# EAGLE schematic porta_stella (EAGLE 9.1.3)
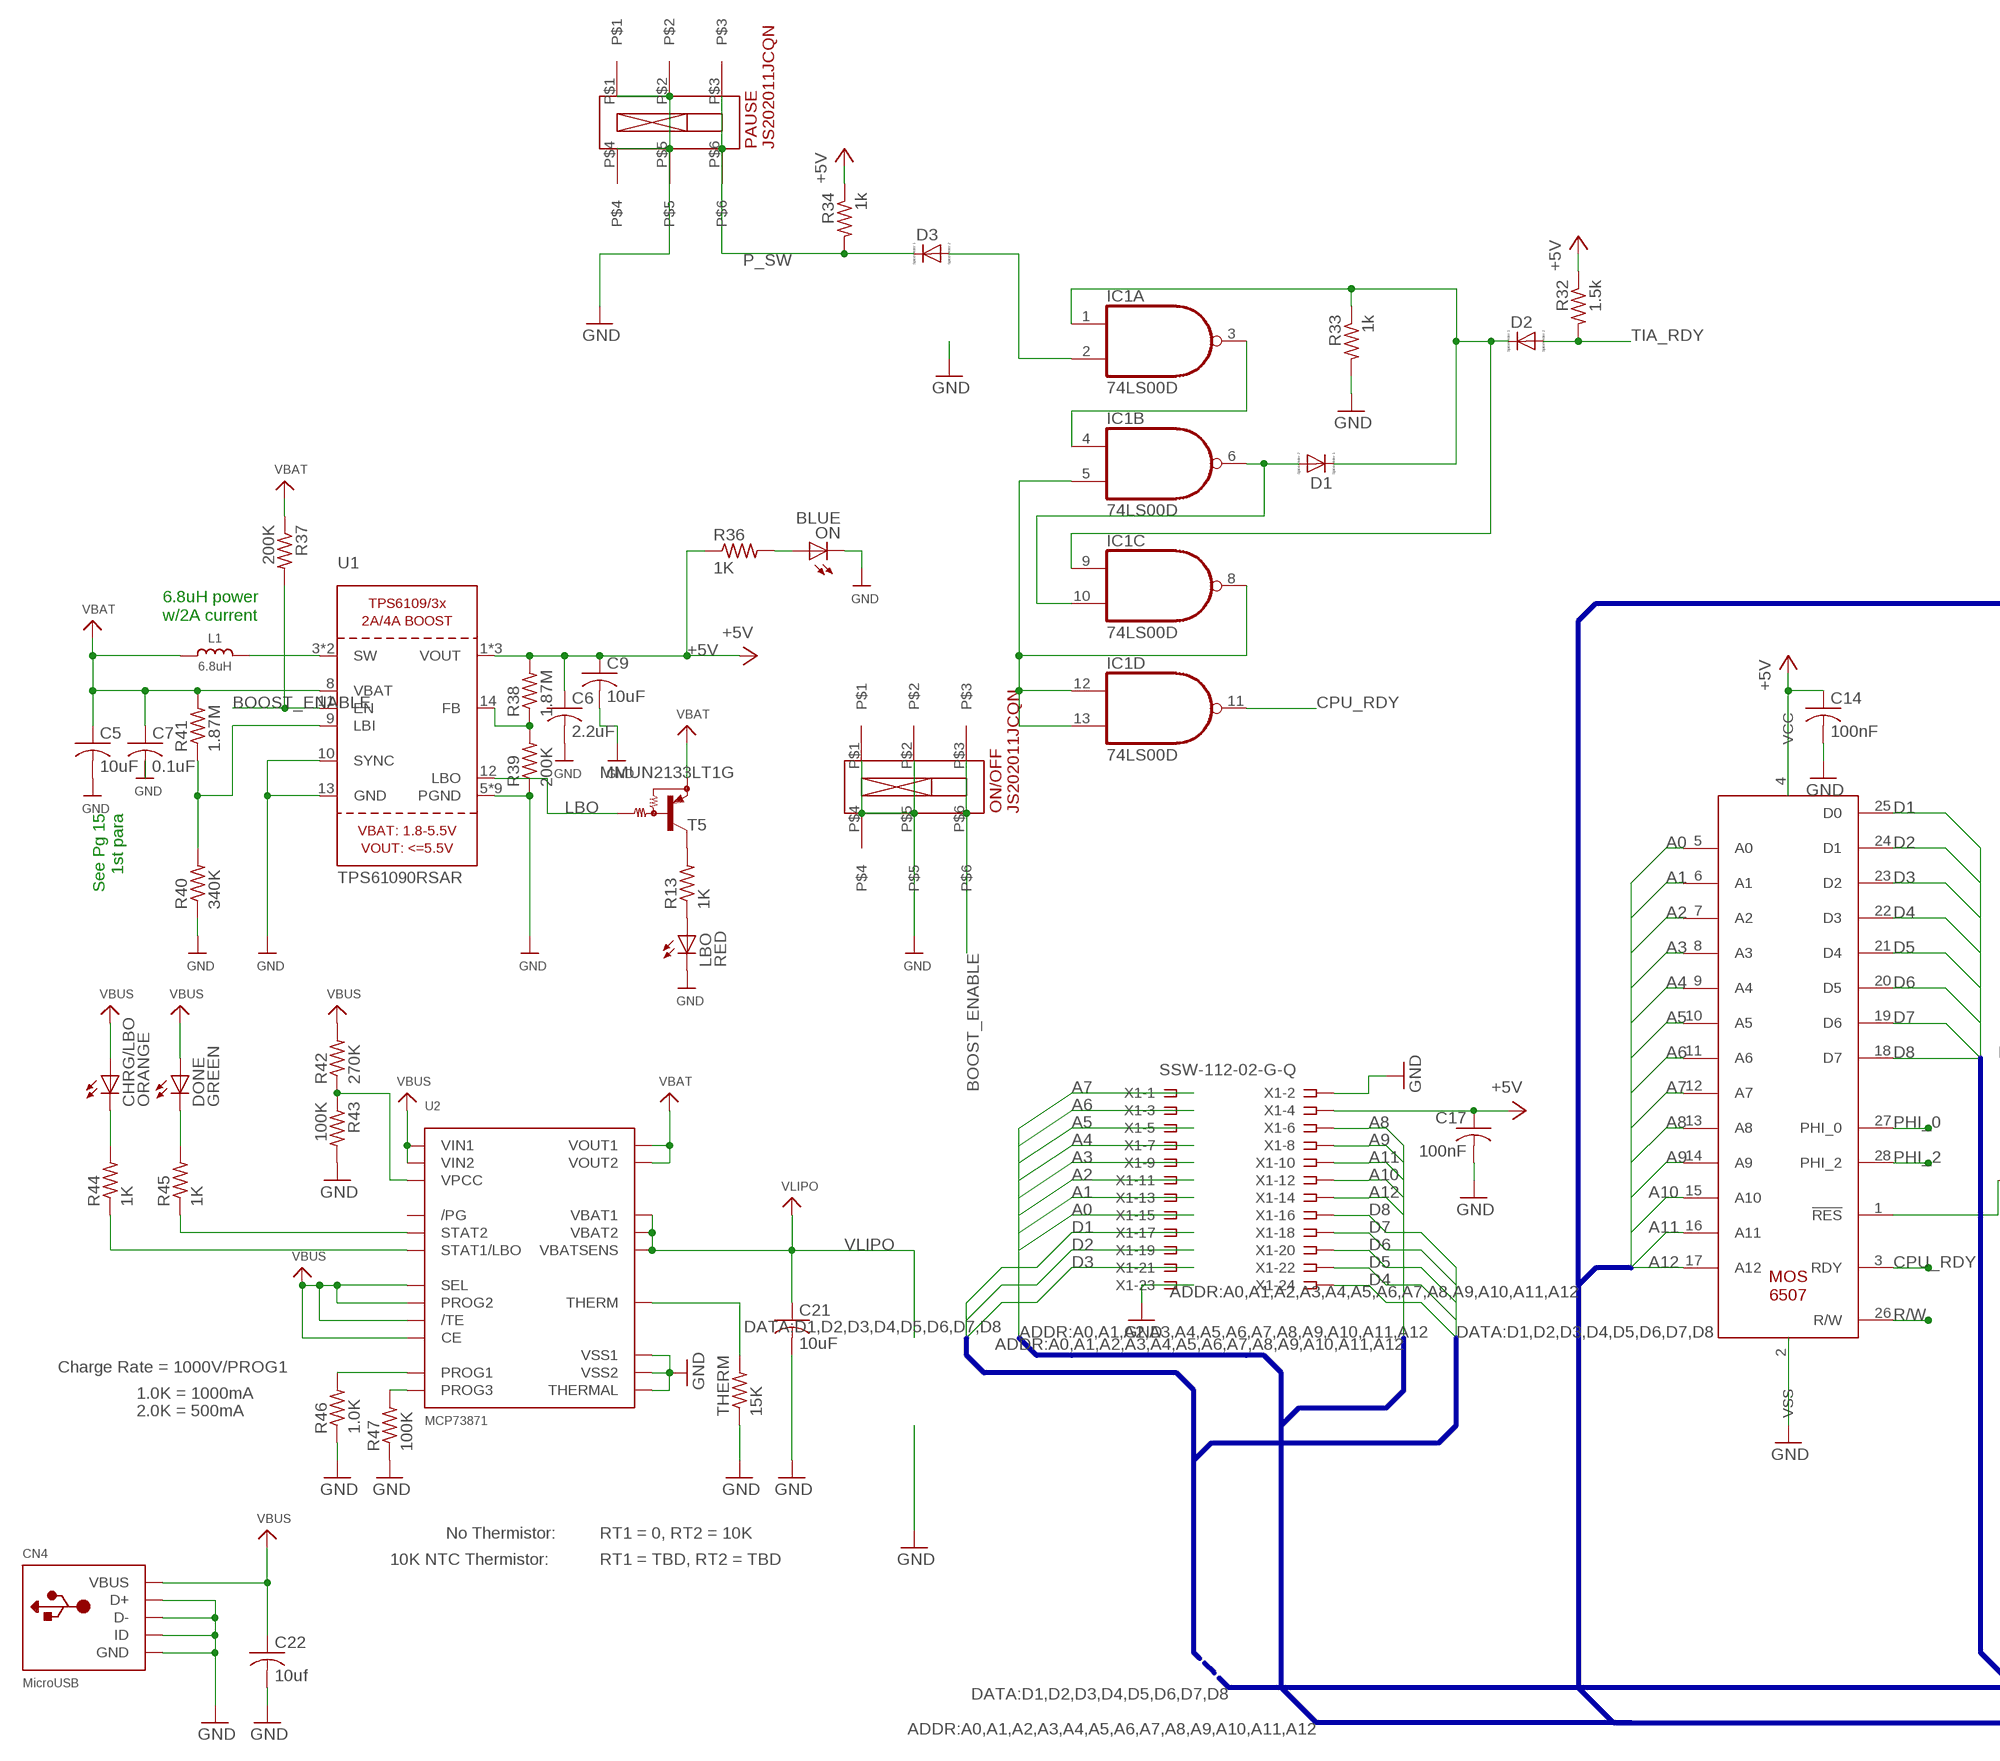
[diagram p0: schematic, sheet 1, part 1 of 2]
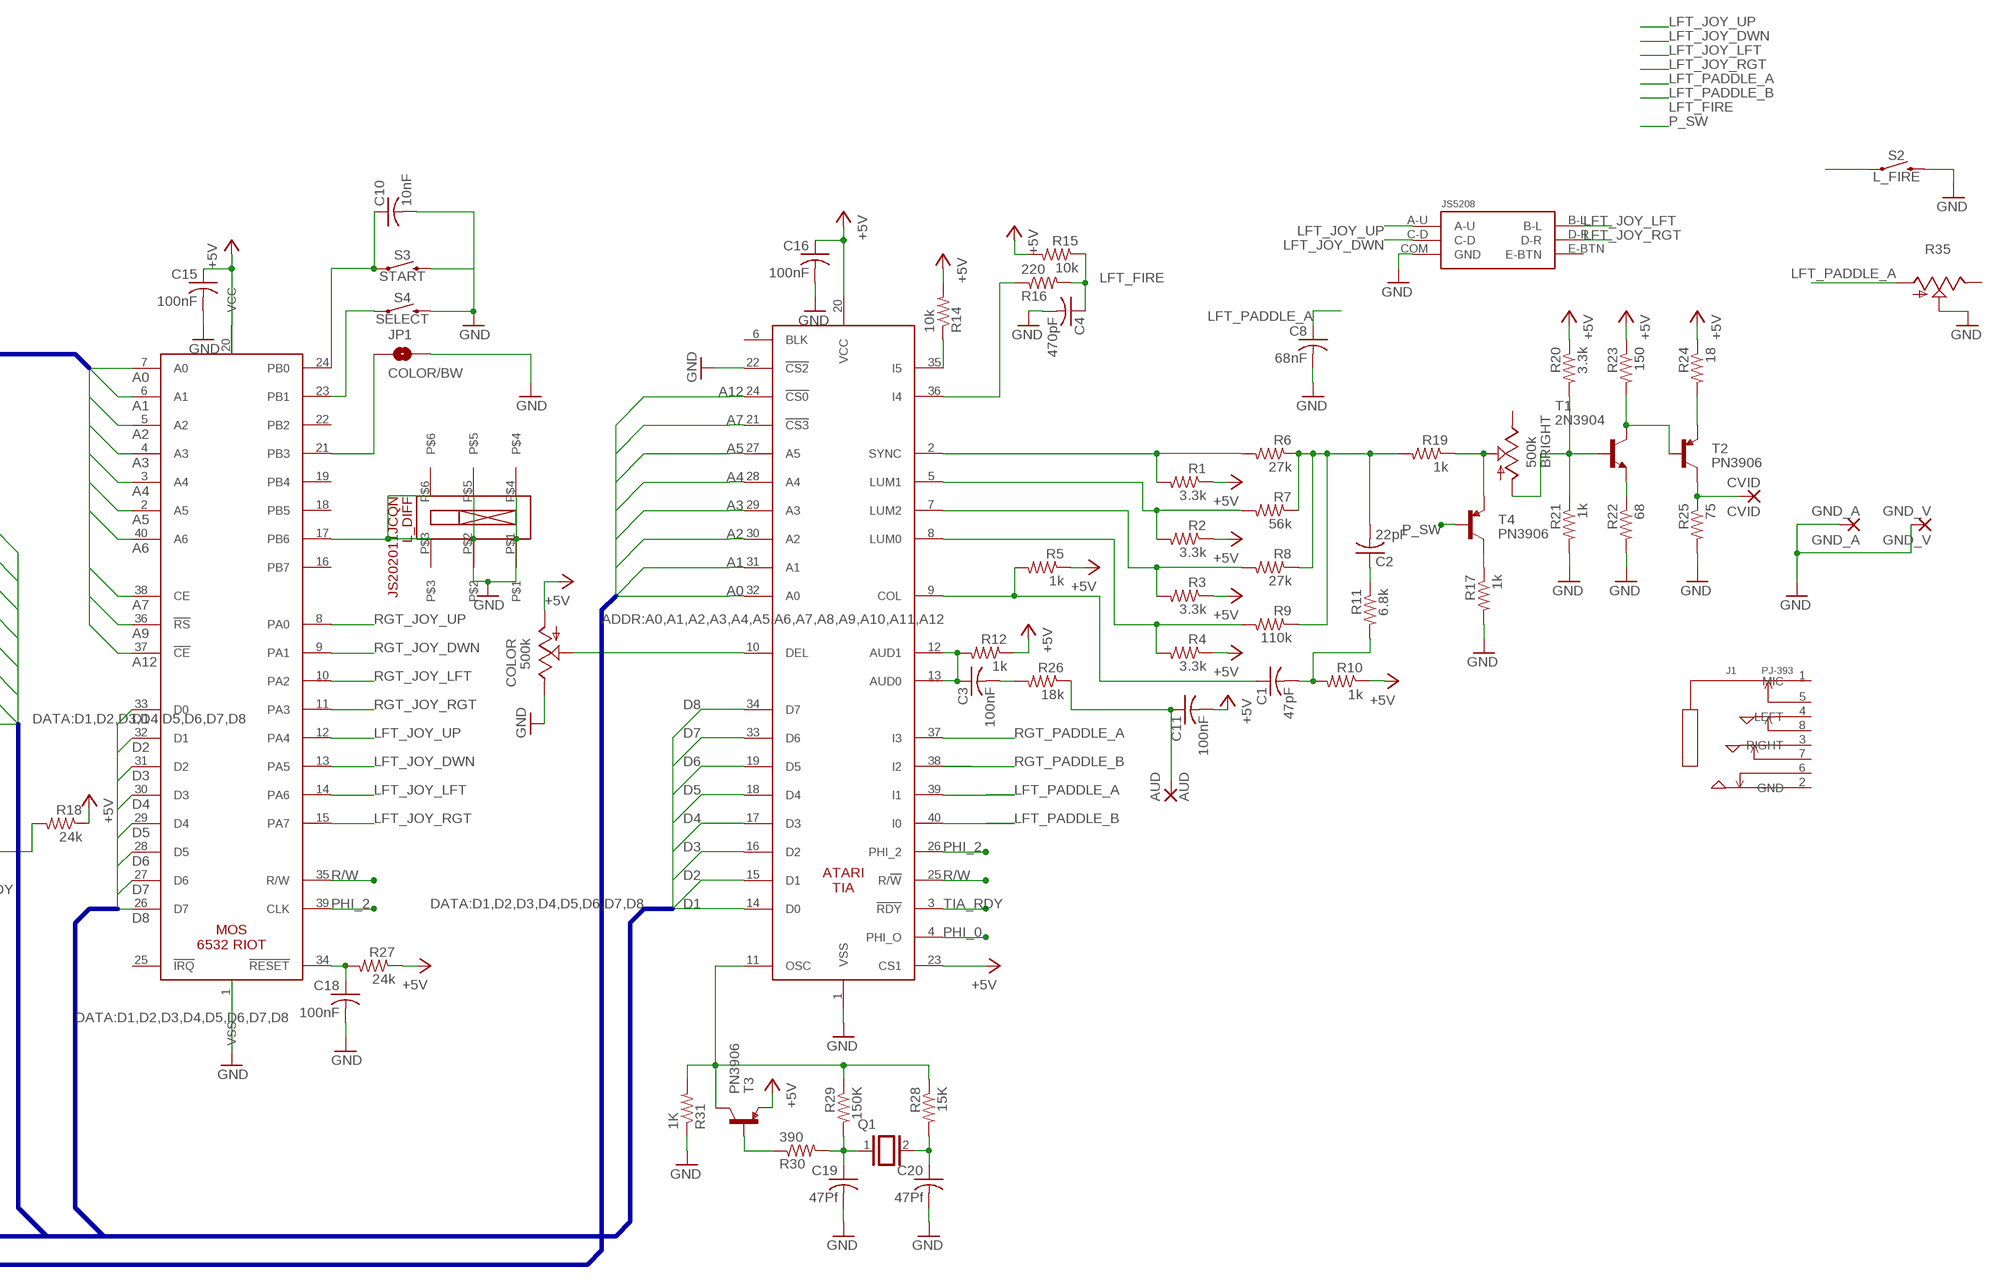
[diagram p1: schematic, sheet 1, part 2 of 2]

## Parts
6507  MOS_6507  [DIL28]
6532  MOS_6532  [DIL40]
AUD  AUD  WIREPAD2,54/1,1  [2,54/1,1]
BRIGHT  500k  TRIM_US-3223G  [3223G]
C1  47pF  C-USC0805  [C0805]
C2  22pF  C-USC0805  [C0805]
C3  100nF  C-USC0805  [C0805]
C4  470pF  C-USC0805  [C0805]
C5  10uF  C-USC1210  [C1210]
C6  2.2uF  C-USC0805  [C0805]
C7  0.1uF  C-USC0805  [C0805]
C8  68nF  C-USC0805  [C0805]
C9  10uF  C-USC1210  [C1210]
C10  10nF  C-USC0805  [C0805]
C11  100nF  C-USC0805  [C0805]
C14  100nF  C-USC0805  [C0805]
C15  100nF  C-USC0805  [C0805]
C16  100nF  C-USC0805  [C0805]
C17  100nF  C-USC0805  [C0805]
C18  100nF  C-USC0805  [C0805]
C19  47Pf  C-USC0805  [C0805]
C20  47Pf  C-USC0805  [C0805]
C21  10uF  C-USC1210  [C1210]
C22  10uf  C-USC0805  [C0805]
CHRG/LBO  ORANGE  ADAFRUIT_LEDCHIPLED_0603  [ADAFRUIT_CHIPLED_0603]
CN4  MicroUSB  USBMICRO_20329  [4UCONN_20329]
COLOR  500k  TRIM_US-3223G  [3223G]
CVID  CVID  WIREPAD2,54/1,1  [2,54/1,1]
D1  DIODE_E-  [DIODE_SMB]
D2  DIODE_E-  [DIODE_SMB]
D3  DIODE_E-  [DIODE_SMB]
DONE  GREEN  ADAFRUIT_LEDCHIPLED_0603  [ADAFRUIT_CHIPLED_0603]
GND_A  GND_A  WIREPAD2,54/1,1  [2,54/1,1]
GND_V  GND_V  WIREPAD2,54/1,1  [2,54/1,1]
IC1  74LS00D  [SO14]
J1  PJ-393  AUDIO-JACK-PJ-393(8P-SMD)  [AUDIO8P-SMD-3.5-14.5X6.1X4.0MM]
JP1  COLOR/BW  JUMPER-SMT_2_NO_NO-SILK  [SMT-JUMPER_2_NO_NO-SILK]
L1  6.8uH  INDUCTORTDK_VLC5045  [INDUCTOR_5X5MM_TDK_VLC5045]
L_DIFF  JS202011JCQN  [JS202011JCQN]
LBO  RED  ADAFRUIT_LEDCHIPLED_0603  [ADAFRUIT_CHIPLED_0603]
ON  BLUE  ADAFRUIT_LEDCHIPLED_0603  [ADAFRUIT_CHIPLED_0603]
ON/OFF  JS202011JCQN  [JS202011JCQN]
PAUSE  JS202011JCQN  [JS202011JCQN]
Q1  XTAL/S  [QS]
R1  3.3k  R-US_M0805  [M0805]
R2  3.3k  R-US_M0805  [M0805]
R3  3.3k  R-US_M0805  [M0805]
R4  3.3k  R-US_M0805  [M0805]
R5  1k  R-US_M0805  [M0805]
R6  27k  R-US_M0805  [M0805]
R7  56k  R-US_M0805  [M0805]
R8  27k  R-US_M0805  [M0805]
R9  110k  R-US_M0805  [M0805]
R10  1k  R-US_M0805  [M0805]
R11  6.8k  R-US_M0805  [M0805]
R12  1k  R-US_M0805  [M0805]
R13  1K  R-US_R0805  [R0805]
R14  10k  R-US_M0805  [M0805]
R15  10k  R-US_M0805  [M0805]
R16  220  R-US_M0805  [M0805]
R17  1k  R-US_M0805  [M0805]
R18  24k  R-US_M0805  [M0805]
R19  1k  R-US_M0805  [M0805]
R20  3.3k  R-US_M0805  [M0805]
R21  1k  R-US_M0805  [M0805]
R22  68  R-US_M0805  [M0805]
R23  150  R-US_M0805  [M0805]
R24  18  R-US_M0805  [M0805]
R25  75  R-US_M0805  [M0805]
R26  18k  R-US_M0805  [M0805]
R27  24k  R-US_M0805  [M0805]
R28  15K  R-US_M0805  [M0805]
R29  150K  R-US_M0805  [M0805]
R30  390  R-US_M0805  [M0805]
R31  1K  R-US_M0805  [M0805]
R32  1.5k  R-US_M0805  [M0805]
R33  1k  R-US_M0805  [M0805]
R34  1k  R-US_M0805  [M0805]
R35  TRIM_US-ECP10S  [ECP10S]
R36  1K  R-US_R0805  [R0805]
R37  200K  R-US_R0805  [R0805]
R38  1.87M  R-US_R0805  [R0805]
R39  200K  R-US_R0805  [R0805]
R40  340K  R-US_R0805  [R0805]
R41  1.87M  R-US_R0805  [R0805]
R42  270K  R-US_R0805  [R0805]
R43  100K  R-US_R0805  [R0805]
R44  1K  R-US_R0805  [R0805]
R45  1K  R-US_R0805  [R0805]
R46  1.0K  R-US_R0805  [R0805]
R47  100K  R-US_R0805  [R0805]
S2  L_FIRE  MOMENTARY-SWITCH-SPST-SMD-5.2MM  [TACTILE_SWITCH_SMD_5.2MM]
S3  START  MOMENTARY-SWITCH-SPST-SMD-6.0X3.5MM  [TACTILE_SWITCH_SMD_6.0X3.5MM]
S4  SELECT  MOMENTARY-SWITCH-SPST-SMD-6.0X3.5MM  [TACTILE_SWITCH_SMD_6.0X3.5MM]
T1  2N3904  MMBT3904LT1-NPN-SOT23-BEC  [SOT23-BEC]
T2  PN3906  TRANSISTOR_PNPPMBT3906  [SOT23-3]
T3  PN3906  TRANSISTOR_PNPPMBT3906  [SOT23-3]
T4  PN3906  TRANSISTOR_PNPPMBT3906  [SOT23-3]
T5  MMUN2133LT1G  TRANSISTOR_MUN2113T1-PNP_DRIVER-SC59-BEC  [TRANSISTOR_SC59-BEC]
THERM  15K  R-US_R0805  [R0805]
TIA  ATARI_TIA  [DIL40]
U1  TPS61090RSAR  VREG_TPS6103X  [PVQFN-16]
U2  MCP73871  [QFN20_4MM]
U$5  JS5208  [JS5208_PKG]
X1  SSW-112-02-G-Q  [SSW-112-02-G-Q]

## Nets
+5V: 6507.4(VCC) 6532.20(VCC) C6.1 C9.1 C11.2 C14.1 C15.1 C16.1 C17.1 COLOR.1(A) R1.1 R2.1 R3.1 R4.1 R5.1 R10.1 R12.1 R14.2 R15.2 R18.1 R20.1 R23.1 R24.1 R27.1 R32.1 R34.1 R36.1 R38.2 T3.2(E) TIA.20(VCC) TIA.23(CS1) U1.1(VOUT) U1.15(VOUT) U1.16(VOUT) X1.4
A0: 6507.5(A0) 6532.7(A0) TIA.32(A0) X1.15
A1: 6507.6(A1) 6532.6(A1) TIA.31(A1) X1.13
A2: 6507.7(A2) 6532.5(A2) TIA.30(A2) X1.11
A3: 6507.8(A3) 6532.4(A3) TIA.29(A3) X1.9
A4: 6507.9(A4) 6532.3(A4) TIA.28(A4) X1.7
A5: 6507.10(A5) 6532.2(A5) TIA.27(A5) X1.5
A6: 6507.11(A6) 6532.40(A6) X1.3
A7: 6507.12(A7) 6532.38(CE) TIA.21(!CS3) X1.1
A8: 6507.13(A8) X1.6
A9: 6507.14(A9) 6532.36(!RS) X1.8
A10: 6507.15(A10) X1.12
A11: 6507.16(A11) X1.10
A12: 6507.17(A12) 6532.37(!CE) TIA.24(!CS0) X1.14
BOOST_ENABLE: ON/OFF.P$3 ON/OFF.P$6 R37.2 U1.11(EN)
CPU_RDY: 6507.3(RDY) IC1.11(D:O)
D1: 6507.25(D0) 6532.33(D0) TIA.14(D0) X1.17
D2: 6507.24(D1) 6532.32(D1) TIA.15(D1) X1.19
D3: 6507.23(D2) 6532.31(D2) TIA.16(D2) X1.21
D4: 6507.22(D3) 6532.30(D3) TIA.17(D3) X1.24
D5: 6507.21(D4) 6532.29(D4) TIA.18(D4) X1.22
D6: 6507.20(D5) 6532.28(D5) TIA.19(D5) X1.20
D7: 6507.19(D6) 6532.27(D6) TIA.33(D6) X1.18
D8: 6507.18(D7) 6532.26(D7) TIA.34(D7) X1.16
GND: 6507.2(VSS) 6532.1(VSS) C4.2 C5.2 C6.2 C7.2 C8.2 C9.2 C10.2 C14.2 C15.2 C16.2 C17.2 C18.2 C19.2 C20.2 C21.2 C22.2 CN4.BASE@1(GND) CN4.BASE@2(GND) CN4.D+ CN4.D- CN4.GND CN4.ID CN4.SPRT@1(GND) CN4.SPRT@2(GND) CN4.SPRT@3(GND) CN4.SPRT@4(GND) COLOR.3(E) GND_A.1(P) GND_V.1(P) JP1.2 L_DIFF.P$1 L_DIFF.P$2 L_DIFF.P$4 L_DIFF.P$5 LBO.C ON.C ON/OFF.P$1 ON/OFF.P$2 ON/OFF.P$4 ON/OFF.P$5 PAUSE.P$1 PAUSE.P$2 PAUSE.P$4 PAUSE.P$5 R17.2 R21.2 R22.2 R25.2 R31.1 R33.2 R35.S R39.1 R40.1 R43.2 R46.1 R47.1 S2.3 S3.2 S4.2 THERM.1 TIA.1(VSS) TIA.22(!CS2) U1.5(PGND) U1.6(PGND) U1.7(PGND) U1.10(SYNC) U1.13(GND) U1.P$18(PGND) U1.P$19(PGND) U1.P$20(PGND) U1.P$21(PGND) U1.P$22(PGND) U1.THERMAL(PGND) U2.P$10(VSS1) U2.P$11(VSS2) U2.P$21(THERMAL) U$5.COM(GND) X1.2 X1.23
LBO: T5.B U1.12(LBO)
LFT_FIRE: C4.1 R15.1 R16.2 S2.1
LFT_JOY_DWN: 6532.13(PA5) U$5.C-D
LFT_JOY_LFT: 6532.14(PA6) U$5.B-L
LFT_JOY_RGT: 6532.15(PA7) U$5.D-R
LFT_JOY_UP: 6532.12(PA4) U$5.A-U
LFT_PADDLE_A: C8.1 R35.A TIA.39(I1)
LFT_PADDLE_B: TIA.40(I0)
N$1: R1.2 R6.2 TIA.2(SYNC)
N$2: R2.2 R7.2 TIA.5(LUM1)
N$3: R3.2 R8.2 TIA.7(LUM2)
N$4: R4.2 R9.2 TIA.8(LUM0)
N$5: C1.1 R5.2 TIA.9(COL)
N$6: C1.2 R10.2 R11.2
N$7: C2.1 R11.1
N$8: C2.2 R6.1 R7.1 R8.1 R9.1 R19.2
N$9: R14.1 TIA.35(I5)
N$10: L1.P$2 U1.3(SW) U1.4(SW)
N$11: R16.1 TIA.36(I4)
N$12: R40.2 R41.1 U1.9(LBI)
N$13: BRIGHT.2(S) R19.1 T4.2(E)
N$14: BRIGHT.1(A) R20.2 R21.1 T1.B
N$15: R22.1 T1.E
N$16: R23.2 T1.C T2.1(B)
N$17: COLOR.2(S) TIA.10(DEL)
N$18: 6532.24(PB0) C10.1 S3.1
N$19: 6532.23(PB1) S4.1
N$20: 6532.21(PB3) JP1.1
N$21: 6532.17(PB6) L_DIFF.P$3 L_DIFF.P$6
N$22: LBO.A R13.1
N$23: 6507.1(!RES) R18.2
N$24: R24.2 T2.2(E)
N$25: CVID.1(P) R25.1 T2.3(C)
N$26: C3.2 R26.2
N$27: C3.1 R12.2 TIA.12(AUD1) TIA.13(AUD0)
N$28: AUD.1(P) C11.1 R26.1
N$29: 6532.34(!RESET) C18.1 R27.2
N$30: C20.1 Q1.2 R28.2
N$31: C19.1 Q1.1 R29.2 R30.2
N$32: R28.1 R29.1 R31.2 T3.3(C) TIA.11(OSC)
N$33: R30.1 T3.1(B)
N$34: R17.1 T4.3(C)
N$35: IC1.5(B:I1) IC1.8(C:O) IC1.12(D:I0) IC1.13(D:I1)
N$36: D3.A(C) IC1.2(A:I1)
N$37: R38.1 R39.2 U1.14(FB)
N$38: IC1.3(A:O) IC1.4(B:I0)
N$39: D1.A(C) IC1.6(B:O) IC1.10(C:I1)
N$40: D1.C(A) D2.C(A) IC1.1(A:I0) IC1.9(C:I0) R33.1
N$41: R13.2 T5.C
N$42: ON.A R36.2
N$43: R42.1 R43.1 U2.P$2(VPCC)
N$44: R45.1 U2.P$7(STAT2)
N$45: R44.1 U2.P$8(STAT1/LBO)
N$46: R46.2 U2.P$13(PROG1)
N$47: THERM.2 U2.P$5(THERM)
N$48: DONE.C R45.2
N$49: CHRG/LBO.C R44.2
N$50: R47.2 U2.P$12(PROG3)
P_SW: D3.C(A) PAUSE.P$3 PAUSE.P$6 R34.2 T4.1(B)
PHI_0: 6507.27(PHI_0) TIA.4(PHI_O)
PHI_2: 6507.28(PHI_2) 6532.39(CLK) TIA.26(PHI_2)
R/W: 6507.26(R/W) 6532.35(R/W) TIA.25(R/!W)
RGT_JOY_DWN: 6532.9(PA1)
RGT_JOY_LFT: 6532.10(PA2)
RGT_JOY_RGT: 6532.11(PA3)
RGT_JOY_UP: 6532.8(PA0)
RGT_PADDLE_A: TIA.37(I3)
RGT_PADDLE_B: TIA.38(I2)
TIA_RDY: D2.A(C) R32.2 TIA.3(!RDY)
VBAT: C5.1 C7.1 L1.P$1 R37.1 R41.2 T5.E U1.8(VBAT) U2.P$1(VOUT1) U2.P$20(VOUT2)
VBUS: C22.1 CHRG/LBO.A CN4.VBUS DONE.A R42.2 U2.P$3(SEL) U2.P$4(PROG2) U2.P$9(/TE) U2.P$17(CE) U2.P$18(VIN1) U2.P$19(VIN2)
VLIPO: C21.1 U2.P$14(VBAT1) U2.P$15(VBAT2) U2.P$16(VBATSENS)
Unconnected: 6532.16(PB7) 6532.18(PB5) 6532.19(PB4) 6532.22(PB2) 6532.25(!IRQ) BRIGHT.3(E) J1.1(MIC) J1.2(GND) J1.3(RIGHT) J1.4(LEFT) J1.5 J1.6 J1.7 J1.8 R35.E TIA.6(BLK) U2.P$6(/PG) U$5.E-BTN

## Buses
DATA:D1,D2,D3,D4,D5,D6,D7,D8
ADDR:A0,A1,A2,A3,A4,A5,A6,A7,A8,A9,A10,A11,A12

## Notes on the sheet
- 6.8uH power
  w/2A current
- See Pg 15
  1st para
- Charge Rate = 1000V/PROG1
- 1.0K = 1000mA
- 2.0K = 500mA
- No Thermistor: | RT1 = 0, RT2 = 10K
- 10K NTC Thermistor: | RT1 = TBD, RT2 = TBD

## Power pins joined to a net without a drawn wire
GND: IC1.7(P:GND)
VCC: IC1.14(P:VCC)

## Library data of the parts
6507 = tiny_stella:MOS_6507
6532 = tiny_stella:MOS_6532
AUD CVID GND_A GND_V = wirepad:WIREPAD: Wire PAD connect wire on PCB
BRIGHT COLOR R35 = pot:TRIM_US-: POTENTIOMETER
C1-C5 C8-C11 C14-C21 = resistor:C-US: CAPACITOR, American symbol
C6 C7 C22 = adafruit:C-US: CAPACITOR, American symbol
CHRG/LBO DONE LBO ON = piboy_new:ADAFRUIT_LED: LED OSRAM: - CHIPLED LG R971, LG N971, LY N971, LG Q971, LY Q971, LO R971, LY R971 LH N974, LH R974 LS Q976, LO Q976, LY Q976 LO Q996 - Hyper CHIPLED LW Q18S LB Q993, LB Q99A, LB R99A - SideLED LS A670, LO A670, LY A670, LG A670, LP A670 LB A673, LV A673, LT A673, LW A673 LH A674 LY A675 LS A676, LA A676, LO A676, LY A676, LW A676 LS A679, LY A679, LG A679 - Hyper Micro SIDELED® LS Y876, LA Y876, LO Y876, LY Y876 LT Y87S - SmartLED LW L88C, LW L88S LB L89C, LB L89S, LG L890 LS L89K, LO L89K, LY L89K LS L896, LA L896, LO L896, LY L896 - TOPLED LS T670, LO T670, LY T670, LG T670, LP T670 LSG T670, LSP T670, LSY T670, LOP T670, LYG T670 LG T671, LOG T671, LSG T671 LB T673, LV T673, LT T673, LW T673 LH T674 LS T676, LA T676, LO T676, LY T676, LB T676, LH T676, LSB T676, LW T676 LB T67C, LV T67C, LT T67C, LS T67K, LO T67K, LY T67K, LW E67C LS E67B, LA E67B, LO E67B, LY E67B, LB E67C, LV E67C, LT E67C LW T67C LS T679, LY T679, LG T679 LS T770, LO T770, LY T770, LG T770, LP T770 LB T773, LV T773, LT T773, LW T773 LH T774 LS E675, LA E675, LY E675, LS T675 LS T776, LA T776, LO T776, LY T776, LB T776 LHGB T686 LT T68C, LB T68C - Hyper Mini TOPLED® LB M676 - Mini TOPLED Santana® LG M470 LS M47K, LO M47K, LY M47K Source: http://www.osram.convergy.de/
CN4 = microbuilder:USB: USB Connectors USBMINIB - Surface Mount Female Mini-B USB Connector 4UConnector: 06564
D1-D3 = eagle-ltspice:DIODE_E-: Schottky Diode; SPICEMODEL: diode; SPICEPREFIX: D
IC1 = 74xx-us:74*00: Quad 2-input NAND gate
J1 = Seeed-Connector:AUDIO-JACK-PJ-393(8P-SMD): 320040009; MPN: PJ-393
JP1 = SparkFun-Jumpers:JUMPER-SMT_2_NO: Normally open jumper This jumper has two pads in close proximity to each other. Apply solder to close the connection. Round pads are easier to solder for beginners, but are a lot larger. SparkFun Product that uses the round pads: SparkFun EL Sequencer <https://www.sparkfun.com/products/12781>
L1 = microbuilder:INDUCTOR: Inductors 0603: 10nH Ceramic Inductor - microwire antenna/RF (Digikey: 712-1434-2-ND) 0805: 560nH Ceramic Inductor - RF (Digikey: 553-1047-1-ND) 270nH Ceramic Inductor - Q = 40@250MHz, +-5%, 1 Ohm DC Resistance (Digikey: 535-10506-2-ND) 1007 (2518 Metric) SMT: 10µH 10% 250mOhm 820mA 1007 Inductor (Digikey: 587-2189-1-ND) 22µH 10% 500mOhm 580mA 1007 Inductor (Digikey: 587-2190-1-ND) 47µH 10% 950mOhm 420mA 1007 Inductor (Digikey: 587-2191-1-ND) 47µH 5% 100mOhm 1A 1008 Inductor (Digikey: 732-1816-1-ND) 5.0x5.0mm (Taiyo Yuden NR5040 Series) 6.8µH 20% 2.3A 64mOhm Inductor (Digikey: 587-2374-2-ND) 5.0x5.0mm (TDK VLC5045 Series) 4.7µH 20% 3.3A 34mOhm Inductor (Digikey: 445-6526-1-ND) 6.8µH 20% 2.7A 46mOhm Inductor (Digikey: 445-6527-1-ND) 6.0x6.0mm (TDK VLC6045 Series) 4.7µH 20% 3.8A 27mOhm Inductor (Digikey: 445-6538-2-ND) 6.8µH 20% 3A 41mOhm Inductor (Digikey: 445-6540-1-ND) 6.2µH 30% 2.2A 45mOhm Inductor (Digikey: SRR5028-6R2YCT-ND) - Not TDK VLC6045 but footprint should match 6.0x6.0mm (TDK SLF6045 Series) 6.8uH 30% 2A 33mOhm Inductor (Digikey: 445-4572-1-ND, Mouser: 810-SLF645T6R8N2R0PF) 6.0x6.0mm (Sumida CDRH5D28 Series) 6.2uH 30% 1.8A 45mOhm Inductor (Digikey: 308-1542-1-ND) Taiyo Yuden NR3015T2R2M - 2.2uH 20% 1.5A (Digikey: 587-1648-2-ND, Mouser: 963-NR3015T2R2M) - Used with TI TPS62172 CoilCraft RFID Transponder Coil - MA5532-AE (For use with AS3935 Lightning Sensor) Vishay IHLP 1.0uH Molded Inductor - 24mOhm DCR, 5A, +/-20%, -55°C-125°C (Digikey: 541-1319-1-ND)
L_DIFF ON/OFF PAUSE = tiny_stella:JS202011JCQN
Q1 = special:XTAL/S: CRYSTAL
R1-R12 R14-R34 = resistor:R-US_: RESISTOR, American symbol
R13 R36-R47 THERM = adafruit:R-US_: RESISTOR, American symbol
S2 = SparkFun-Switches:MOMENTARY-SWITCH-SPST: Momentary Switch (Pushbutton) - SPST Normally-open (NO) SPST momentary switches (buttons, pushbuttons). Variants PTH-12MM - 12mm square, through-hole Momentary Pushbutton Switch - 12mm Square <https://www.sparkfun.com/products/9190> (COM-09190) PTH-6.0MM, PTH-6.0MM-KIT - 6.0mm square, through-hole Mini Pushbutton Switch <https://www.sparkfun.com/products/97> (COM-00097) KIT package intended for soldering kit's - only one side of pads' copper is exposed. PTH-RIGHT-ANGLE-KIT - Right-angle, through-hole Right Angle Tactile Button <https://www.sparkfun.com/products/10791> - Used on SparkFun BigTime Watch Kit <https://www.sparkfun.com/products/11734> SMD-12MM - 12mm square, surface-mount Tactile Button - SMD (12mm) <https://www.sparkfun.com/products/12993> (COM-12993) Used on SparkFun PicoBoard <https://www.sparkfun.com/products/11888> SMD-4.5MM - 4.5mm Square Trackball Switch Used on SparkFun Blackberry Trackballer Breakout <https://www.sparkfun.com/products/13169> SMD-4.6MMX2.8MM - 4.60mm x 2.80mm, surface mount Used on SparkFun SAMD21 Mini Breakout <https://www.sparkfun.com/products/13664> SMD-5.2MM, SMD-5.2-REDUNDANT - 5.2mm square, surface-mount Mini Pushbutton Switch - SMD <https://www.sparkfun.com/products/8720> (COM-08720) Used on Arduino Pro Mini <https://www.sparkfun.com/products/11114> REDUNDANT package connects both switch circuits together SMD-6.0X3.5MM - 6.0 x 3.5mm, surface mount Momentary Reset Switch SMD <https://www.sparkfun.com/products/8229> (COM-08229) SMD-6.2MM-TALL - 6.2mm square, surface mount Tactile Button - SMD (6mm) <https://www.sparkfun.com/products/12992> Used on SparkFun Digital Sandbox <https://www.sparkfun.com/products/12651> SMD-RIGHT-ANGLE - Right-angle, surface mount Used on SparkFun Block for Intel® Edison - Arduino <https://www.sparkfun.com/products/13036>; PROD_ID: SWCH-08247; SF_SKU: COM-08720
S3 S4 = SparkFun-Switches:MOMENTARY-SWITCH-SPST: Momentary Switch (Pushbutton) - SPST Normally-open (NO) SPST momentary switches (buttons, pushbuttons). Variants PTH-12MM - 12mm square, through-hole Momentary Pushbutton Switch - 12mm Square <https://www.sparkfun.com/products/9190> (COM-09190) PTH-6.0MM, PTH-6.0MM-KIT - 6.0mm square, through-hole Mini Pushbutton Switch <https://www.sparkfun.com/products/97> (COM-00097) KIT package intended for soldering kit's - only one side of pads' copper is exposed. PTH-RIGHT-ANGLE-KIT - Right-angle, through-hole Right Angle Tactile Button <https://www.sparkfun.com/products/10791> - Used on SparkFun BigTime Watch Kit <https://www.sparkfun.com/products/11734> SMD-12MM - 12mm square, surface-mount Tactile Button - SMD (12mm) <https://www.sparkfun.com/products/12993> (COM-12993) Used on SparkFun PicoBoard <https://www.sparkfun.com/products/11888> SMD-4.5MM - 4.5mm Square Trackball Switch Used on SparkFun Blackberry Trackballer Breakout <https://www.sparkfun.com/products/13169> SMD-4.6MMX2.8MM - 4.60mm x 2.80mm, surface mount Used on SparkFun SAMD21 Mini Breakout <https://www.sparkfun.com/products/13664> SMD-5.2MM, SMD-5.2-REDUNDANT - 5.2mm square, surface-mount Mini Pushbutton Switch - SMD <https://www.sparkfun.com/products/8720> (COM-08720) Used on Arduino Pro Mini <https://www.sparkfun.com/products/11114> REDUNDANT package connects both switch circuits together SMD-6.0X3.5MM - 6.0 x 3.5mm, surface mount Momentary Reset Switch SMD <https://www.sparkfun.com/products/8229> (COM-08229) SMD-6.2MM-TALL - 6.2mm square, surface mount Tactile Button - SMD (6mm) <https://www.sparkfun.com/products/12992> Used on SparkFun Digital Sandbox <https://www.sparkfun.com/products/12651> SMD-RIGHT-ANGLE - Right-angle, surface mount Used on SparkFun Block for Intel® Edison - Arduino <https://www.sparkfun.com/products/13036>; PROD_ID: SWCH-00815; SF_SKU: COM-08229
T1 = transistor:*-NPN-: NPN Transistror BF959 corrected 2008.03.06
T2-T4 = User-Submitted:TRANSISTOR_PNP: Generic PNP BJT Double check pinouts against datasheets- not all devices are the same! MMBT3906 - 40V 200mA SOT-23 (TRANS-08052) MMBT4403 - 40V 600mA SOT-23 (TRANS-09245); PROD_ID: TRANS-08052; VALUE: PMBT3906
T5 = piboy_new:TRANSISTOR_*-PNP_DRIVER-: PNP Bias Resistor Transistor
TIA = tiny_stella:ATARI_TIA
U1 = microbuilder:VREG_TPS6103X: TPS6103x 4A Boost - 1.8-5.5V Input, Adjustable Output to 5.5V
U2 = microbuilder:MCP73871: MCP73871 Lithium Polymer Battery Charger Digikey: MCP73871-2CCI/ML-ND
U$5 = tiny_stella:JS5208
X1 = con-samtec:SSW-112-02-G: THROUGH-HOLE .025" SQ POST SOCKET Source: Samtec SSW.pdf; MF: Samtec Inc.; MPN: SSW-112-02-G-Q